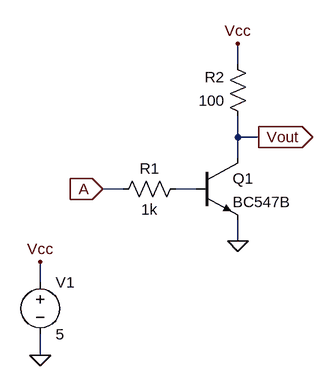
[diagram p0: schematic NOTgate.asc]
NOTgate.asc, the LTspice schematic file:
Version 4
SHEET 1 880 680
WIRE 80 -160 80 -192
WIRE 80 -48 80 -80
WIRE 112 -48 80 -48
WIRE 80 -16 80 -48
WIRE -96 32 -128 32
WIRE 16 32 -16 32
WIRE 80 112 80 80
WIRE -224 176 -224 144
WIRE -224 288 -224 256
FLAG 80 112 0
FLAG -224 288 0
FLAG -224 144 Vcc
FLAG 80 -192 Vcc
FLAG -128 32 A
IOPIN -128 32 In
FLAG 112 -48 Vout
IOPIN 112 -48 Out
SYMBOL npn 16 -16 R0
SYMATTR InstName Q1
SYMATTR Value BC547B
SYMBOL res 0 16 R90
WINDOW 0 0 56 VBottom 2
WINDOW 3 32 56 VTop 2
SYMATTR InstName R1
SYMATTR Value 1k
SYMBOL res 96 -64 R180
WINDOW 0 36 76 Left 2
WINDOW 3 36 40 Left 2
SYMATTR InstName R2
SYMATTR Value 100
SYMBOL voltage -224 160 R0
WINDOW 123 0 0 Left 0
WINDOW 39 0 0 Left 0
SYMATTR InstName V1
SYMATTR Value 5

The netlist it stands for:
* NOTgate.asc
Q1 Vout N001 0 0 BC547B
R1 N001 A 1k
R2 Vout Vcc 100
V1 Vcc 0 5
.model NPN NPN
.model PNP PNP
.lib standard.bjt
.backanno
.end